# Altium schematic sheet Controller_pitch&brake.SchDoc
size A4
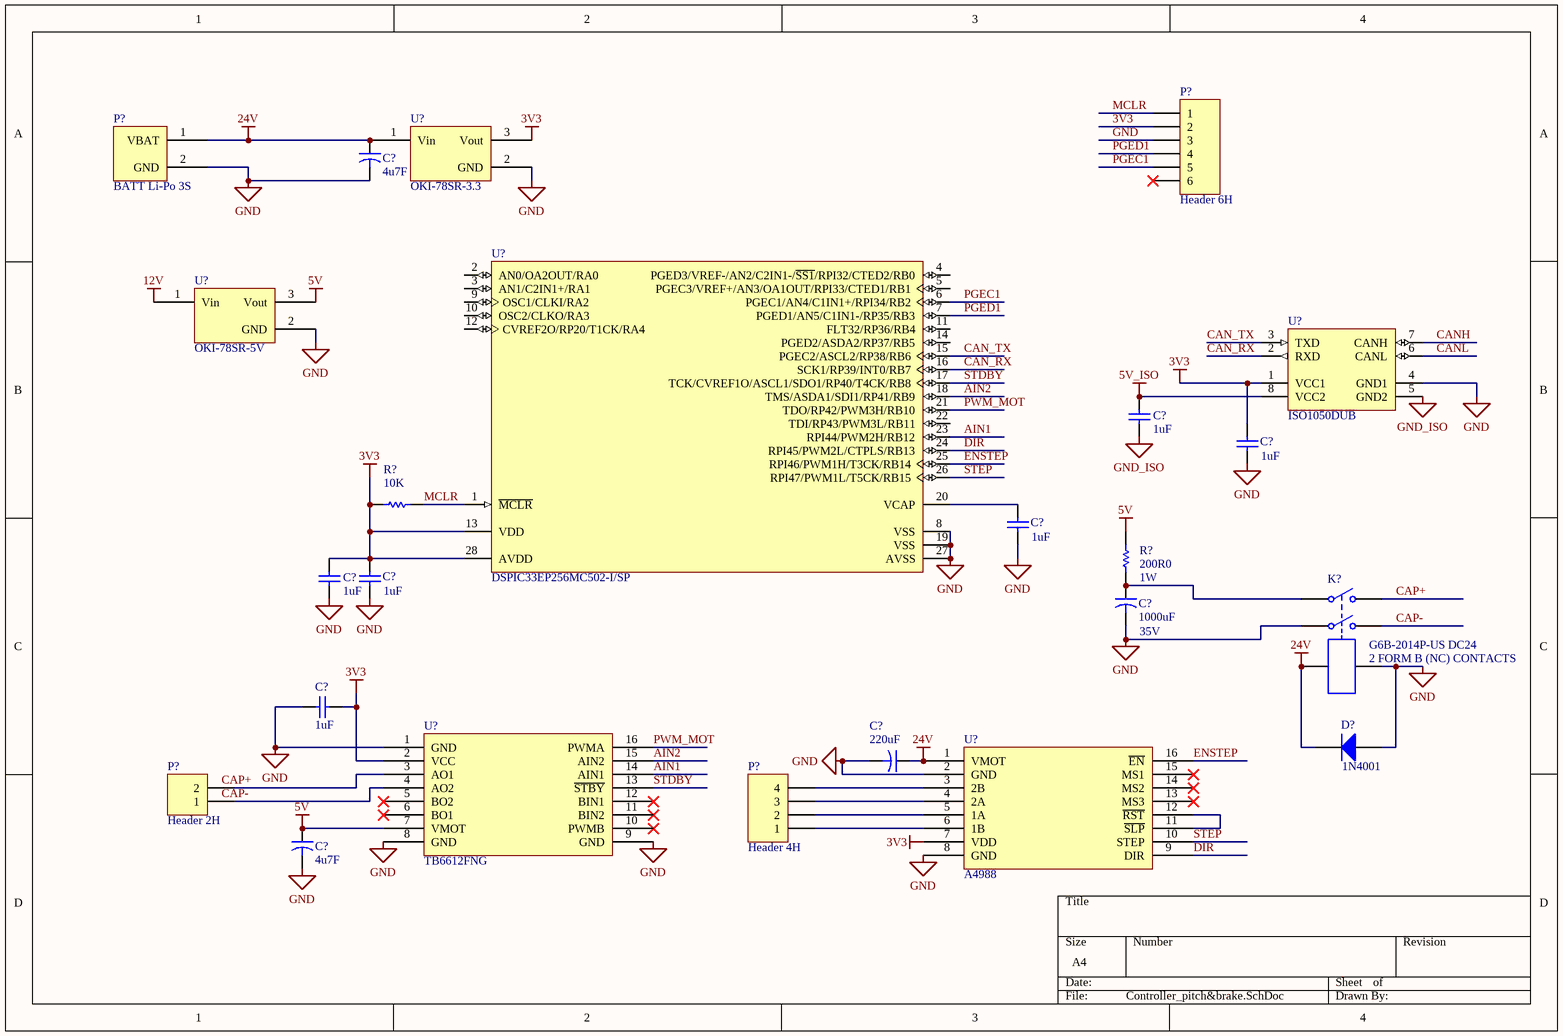
[diagram p0: Controller_pitch&brake.SchDoc]

## Parts
(Parts that share a designator on the sheet are numbered #1, #2 ... from top to bottom, then left to right.)
C?#1  4u7F  [CAP 100uF]
C?#2  value 1uF  [RAD-0.3]  (hidden comment: Cap)
C?#3  value 1uF  [RAD-0.3]  (hidden comment: Cap)
C?#4  value 1uF  [RAD-0.3]  (hidden comment: Cap)
C?#5  value 1uF  [RAD-0.3]  (hidden comment: Cap)
C?#6  value 1uF  [RAD-0.3]  (hidden comment: Cap)
C?#7  1000uF  [CAP 100uF]
C?#8  value 1uF  [RAD-0.3]  (hidden comment: Cap)
C?#9  220uF  [CAP 100uF]
C?#10  4u7F  [CAP 100uF]
D?  1N4001  [DO-41]
K?  G6B-2014P-US DC24  [MODULE6]
P?#1  Header 6H  [HDR1X6]
P?#2  BATT Li-Po 3S  [XT60_CON]
P?#3  Header 2H  [HDR1X2H]
P?#4  Header 4H  [HDR1X4H]
R?#1  value 10K  [AXIAL-0.3]  (hidden comment: Res1)
R?#2  value 200R0  [AXIAL-0.3]  (hidden comment: Res1)
U?#1  OKI-78SR-3.3
U?#2  DSPIC33EP256MC502-I/SP  [MCHP-SPDIP-SP28]
U?#3  ISO1050DUB  [DUB8_N]
U?#4  OKI-78SR-5V
U?#5  TB6612FNG
U?#6  A4988

## Nets
3V3: C?#3.2 C?#5.2 C?#6.2 C?#8.2 P?#1.2 R?#1.1 U?#1.3(Vout) U?#2.13(VDD) U?#2.28(AVDD) U?#3.1(VCC1) U?#5.2(VCC) U?#6.7(VDD)
5V: C?#10.1 R?#2.2 U?#4.3(Vout) U?#5.7(VMOT)
5V_ISO: C?#2.2 U?#3.8(VCC2)
12V: U?#4.1(Vin)
24V: C?#1.1 C?#9.1 D?.2(K) K?.5 P?#2.1(VBAT) U?#1.1(Vin) U?#6.1(VMOT)
GND: C?#1.2 C?#3.1 C?#4.1 C?#5.1 C?#6.1 C?#7.2 C?#8.1 C?#9.2 C?#10.2 D?.1(A) K?.3 K?.6 P?#1.3 P?#2.2(GND) U?#1.2(GND) U?#2.8(VSS) U?#2.19(VSS) U?#2.27(AVSS) U?#3.4(GND1) U?#4.2(GND) U?#5.1(GND) U?#5.8(GND) U?#5.9(GND) U?#6.2(GND) U?#6.8(GND)
GND_ISO: C?#2.1 U?#3.5(GND2)
AIN1: U?#2.23(RPI44/PWM2H/RB12) U?#5.14(AIN1)
AIN2: U?#2.18(TMS/ASDA1/SDI1/RP41/RB9) U?#5.15(AIN2)
CAN_RX: U?#2.16(SCK1/RP39/INT0/RB7) U?#3.2(RXD)
CAN_TX: U?#2.15(PGEC2/ASCL2/RP38/RB6) U?#3.3(TXD)
CANH: U?#3.7(CANH)
CANL: U?#3.6(CANL)
CAP+: K?.2
CAP-: K?.4
DIR: U?#2.24(RPI45/PWM2L/CTPLS/RB13) U?#6.9(DIR)
ENSTEP: U?#2.25(RPI46/PWM1H/T3CK/RB14) U?#6.16(~{EN})
MCLR: P?#1.1 R?#1.2 U?#2.1(~{MCLR})
PGEC1: P?#1.5 U?#2.6(PGEC1/AN4/C1IN1+/RPI34/RB2)
PGED1: P?#1.4 U?#2.7(PGED1/AN5/C1IN1-/RP35/RB3)
PWM_MOT: U?#2.21(TDO/RP42/PWM3H/RB10) U?#5.16(PWMA)
STDBY: U?#2.17(TCK/CVREF1O/ASCL1/SDO1/RP40/T4CK/RB8) U?#5.13(~{STBY})
STEP: U?#2.26(RPI47/PWM1L/T5CK/RB15) U?#6.10(STEP)
NetC?#4_2: C?#4.2 U?#2.20(VCAP)
NetC?#7_1: C?#7.1 K?.1 R?#2.1
NetP?#3_1: P?#3.1 U?#5.4(AO2)
NetP?#3_2: P?#3.2 U?#5.3(AO1)
NetP?#4_1: P?#4.1 U?#6.6(1B)
NetP?#4_2: P?#4.2 U?#6.5(1A)
NetP?#4_3: P?#4.3 U?#6.4(2A)
NetP?#4_4: P?#4.4 U?#6.3(2B)
NetU?#6_11: U?#6.11(~{SLP}) U?#6.12(~{RST})

Not connected (* = marked no-connect by the designer): P?#1 6*; U?#2 2(AN0/OA2OUT/RA0) 3(AN1/C2IN1+/RA1) 4(PGED3/VREF-/AN2/C2IN1-/~{SS1}/RPI32/CTED2/RB0) 5(PGEC3/VREF+/AN3/OA1OUT/RPI33/CTED1/RB1) 9(OSC1/CLKI/RA2) 10(OSC2/CLKO/RA3) 11(FLT32/RP36/RB4) 12(CVREF2O/RP20/T1CK/RA4) 14(PGED2/ASDA2/RP37/RB5) 22(TDI/RP43/PWM3L/RB11); U?#5 5(BO2)* 6(BO1)* 10(PWMB)* 11(BIN2)* 12(BIN1)*; U?#6 13(MS3)* 14(MS2)* 15(MS1)*

## Notes on the sheet
- 1W
- (near C?#7) 35V
- (near K?) 2 FORM B (NC) CONTACTS
- Labels drawn without touching a wire or pin: CAP+, CAP-

## Library data of the parts
C?#1 C?#7 C?#9 C?#10 = CAPDRV
C?#2-C?#6 C?#8 = Cap: Capacitor; Published: 8-Jun-2000; LatestRevisionDate: 17-Jul-2002; LatestRevisionNote: Re-released for DXP Platform.; PackageReference: RAD-0.3; Publisher: Altium Limited; PackageDescription: Radial Cap, Thru-Hole; 2 Leads; 0.3 in Pin Spacing
D? = Diode 1N4001: 1 Amp General Purpose Rectifier; Published: 8-Jun-2000; LatestRevisionDate: 17-Jul-2002; LatestRevisionNote: Re-released for DXP Platform.; DatasheetVersion: 1998; PackageVersion: Aug-1999; PackageReference: DO-41; Publisher: Altium Limited; PackageDescription: Diode, Axial; Body 5.2 x 2.7 mm (LxDia. max), Lead Dia. 0.86 mm (max); Code_JEDEC: DO-204-AL; ComponentLink1Description: Manufacturer Link; ComponentLink1URL: http://www.fairchildsemi.com/; ComponentLink2Description: Datasheet; ComponentLink2URL: http://www.fairchildsemi.com/ds/1N%2F1N4001.pdf
K? = Relay-DPST: Dual-Pole Single-Throw Relay; Published: 24-Mar-1999; LatestRevisionDate: 17-Jul-2002; LatestRevisionNote: Re-released for DXP Platform.; PackageReference: MODULE6; Publisher: Altium Limited
P?#1 = Header 6: Header, 6-Pin; LatestRevisionDate: 17-Jul-2002; LatestRevisionNote: Re-released for DXP Platform.; Publisher: Altium Limited
P?#2 = XT60: BATT Li-Po 22.2V
P?#3 = Header 2H: Header, 2-Pin, Right Angle; LatestRevisionDate: 17-Jul-2002; LatestRevisionNote: Re-released for DXP Platform.; Publisher: Altium Limited
P?#4 = Header 4H: Header, 4-Pin, Right Angle; LatestRevisionDate: 17-Jul-2002; LatestRevisionNote: Re-released for DXP Platform.; Publisher: Altium Limited
R?#1 R?#2 = Res1: Resistor; Published: 8-Jun-2000; LatestRevisionDate: 17-Jul-2002; LatestRevisionNote: Re-released for DXP Platform.; PackageReference: AXIAL-0.3; Publisher: Altium Limited; PackageDescription: Axial Device, Thru-Hole; 2 Leads; 0.3 in Pin Spacing
U?#1 = UA78M33CKCS: LDO 3.3V 500 mA max
U?#2 = DSPIC33EP256MC502-I/SP: 16-Bit Microcontroller and Digital Signal Controller with High-Speed PWM, Op Amps and Advanced Analog, 70 MIPS, 21 I/O, GPIO, -40 to 85 degC, 28-pin SPDIP (SP28), Tube; Manufacturer: Microchip; DatasheetVersion: Rev. F; PackageVersion: C04-070B; PackageReference: SPDIP-SP28; PackageDescription: 28-Lead Plastic Dual In-Line, 34.86 x 6.79 mm Body, 2.54 mm Pitch; Supplier 1: Digi-Key; Supplier Part Number 1: DSPIC33EP256MC502-I/SP-ND; Supplier 2: Farnell; Supplier Part Number 2: 2212186; Supplier 3: Newark; Supplier Part Number 3: 66T8025; Supplier 4: Mouser; Supplier Part Number 4: 579-PC33256MC502ISP; Mounting Technology: Through Hole; PartNumber: DSPIC33EP256MC502-I/SP; ComponentLink1Description: Manufacturer URL; ComponentLink1URL: http://www.microchip.com; ComponentLink2Description: Datasheet; ComponentLink2URL: http://ww1.microchip.com/downloads/en/DeviceDoc/70657F.pdf; ComponentLink3Description: Package Specification; ComponentLink3URL: http://www.microchip.com/stellent/groups/techpub_sg/documents/packagingspec/en012702.pdf; ComponentLink4Description: Product URL; ComponentLink4URL: http://www.microchip.com/dsPIC33EP256MC502
U?#3 = ISO1050DUB: Isolated CAN Transceiver, -55 to 105 degC, 8-pin SOP (DUB), Green (RoHS & no Sb/Br); Manufacturer: Texas Instruments; Drivers Per Package: 1; Isolated: Yes; Rating: Catalog; DatasheetVersion: SLLS983E; PackageVersion: revC, May-2006; PackageReference: DUB8; PackageDescription: 8-Pin Small Outline Package 2.54 mm Pitch; Supplier 1: Digi-Key; Supplier Part Number 1: ISO1050DUB-ND; Supplier 2: Newark; Supplier Part Number 2: 24R9141; Supplier 3: Mouser; Supplier Part Number 3: 595-ISO1050DUB; Eco-Plan: Green (RoHS & no Sb/Br); SubFamily: CAN; Mounting Technology: Surface Mount; PartNumber: ISO1050DUB; ComponentLink1Description: Datasheet; ComponentLink1URL: http://www.ti.com/general/docs/lit/getliterature.tsp?genericPartNumber=ISO1050&fileType=pdf; ComponentLink2Description: Package Specification; ComponentLink2URL: http://www.ti.com/litv/pdf/mpds247b
U?#4 = MC7806CTG: LDO 6V 1A
U?#5 = TB6612FNG: DRIVER DC MOTORS
U?#6 = A4988: DRIVER STEPPER